# EAGLE design makeblock stepper driver (EAGLE 9.2.2)
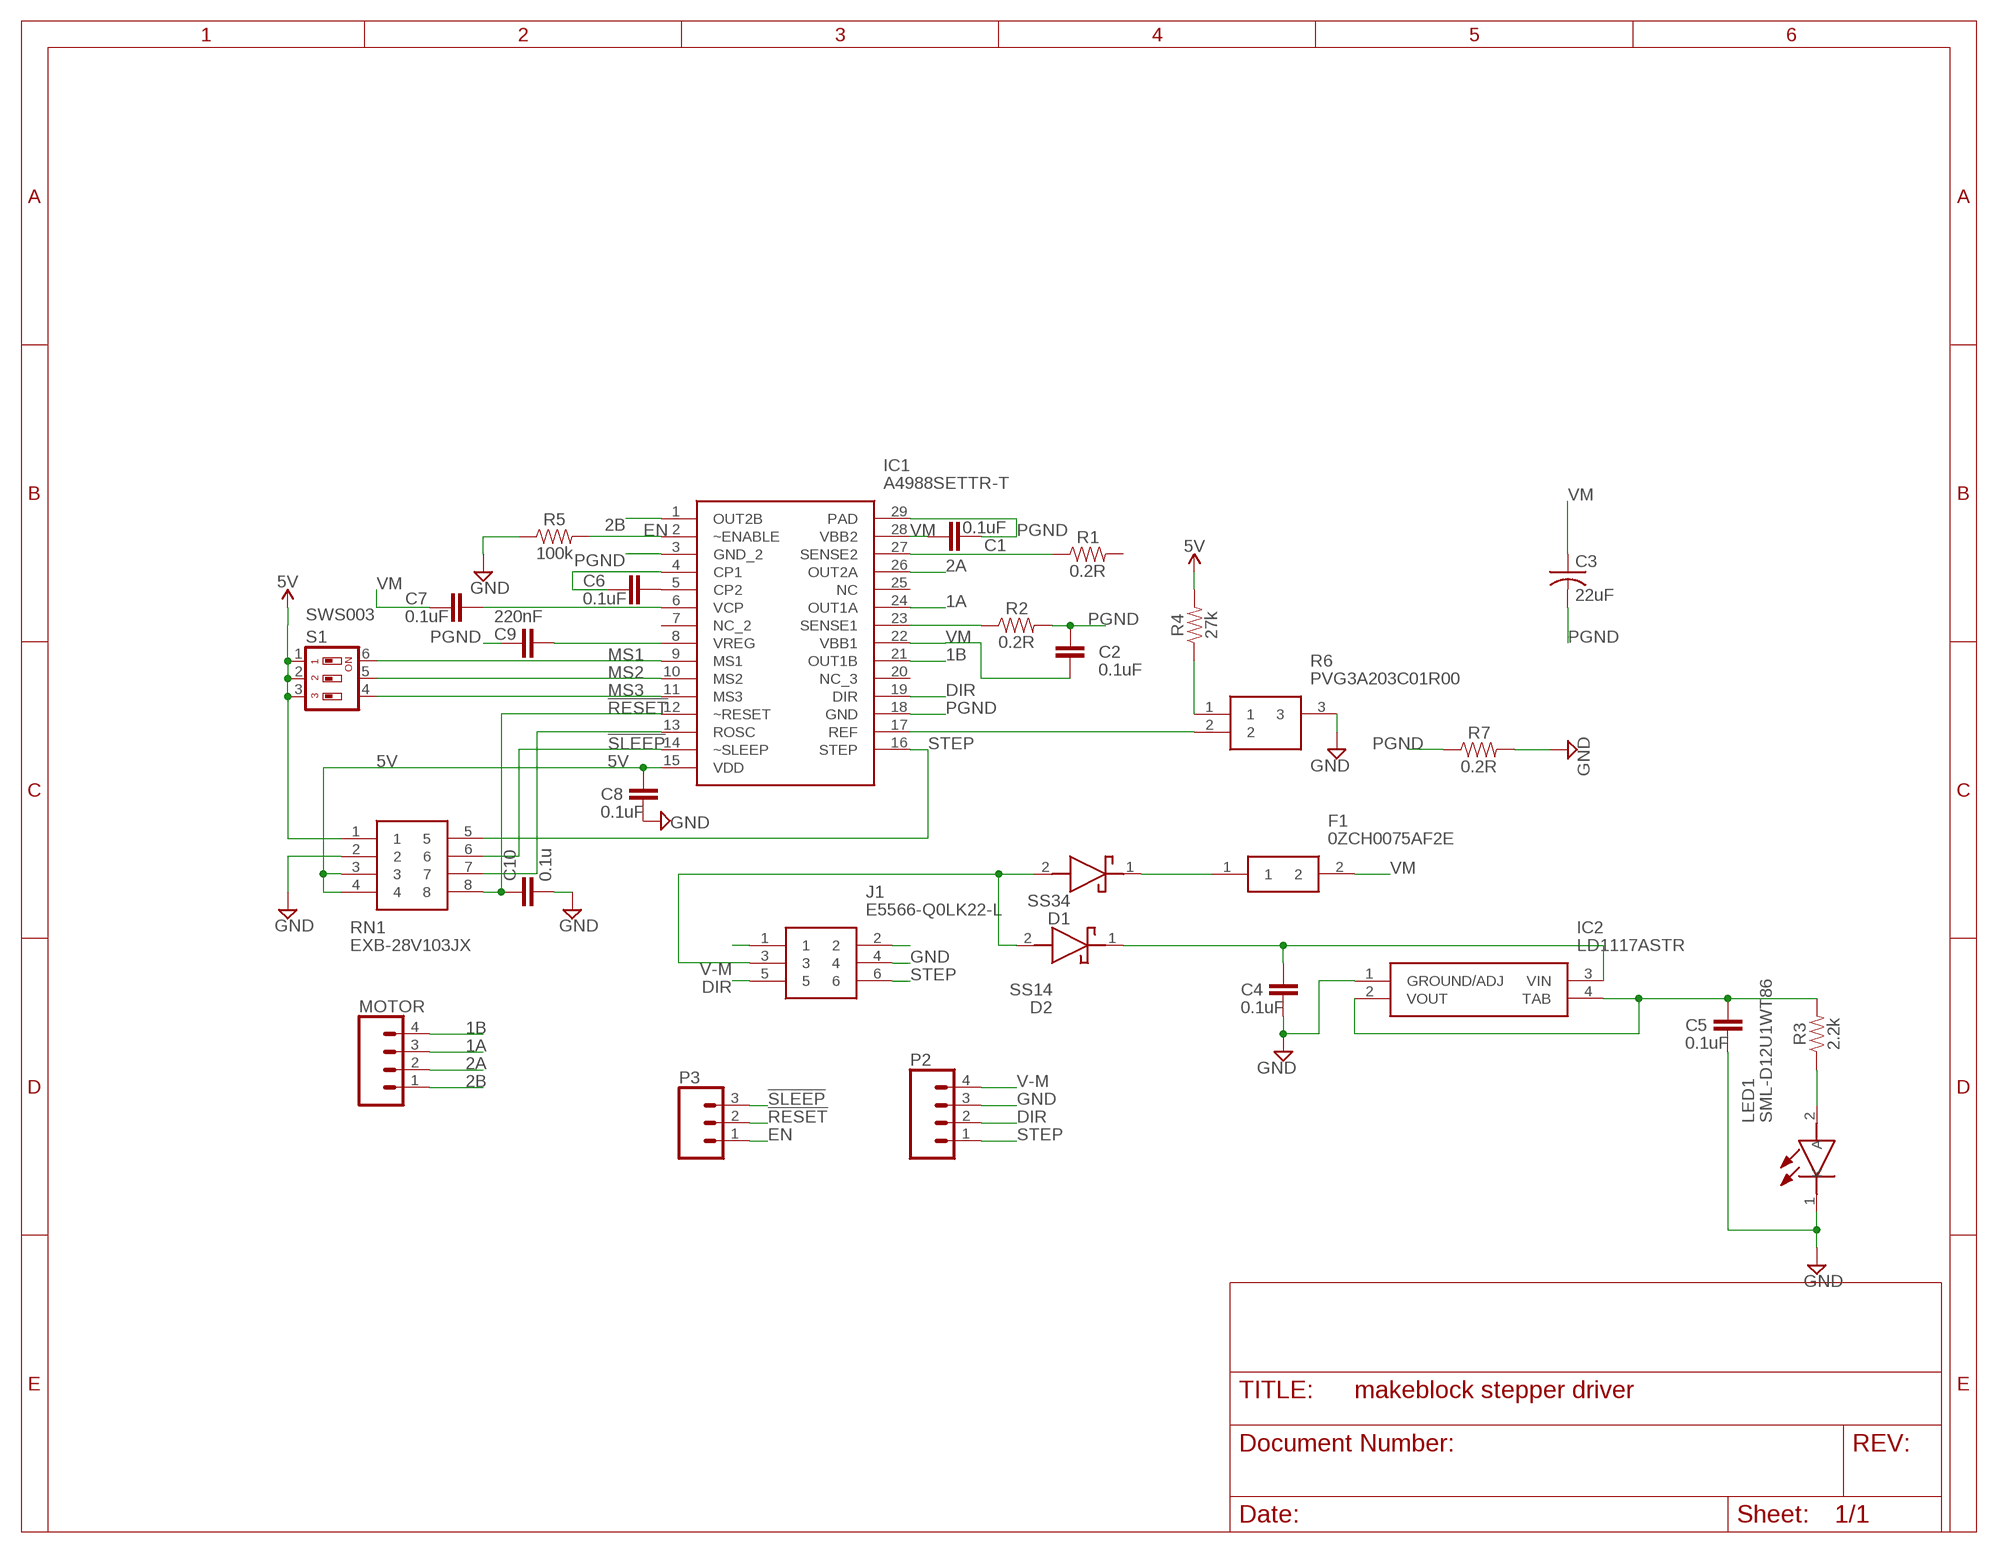
[diagram p0: schematic, sheet 1]

## Parts
C1  0.1uF  C-EUC0402  [C0402]
C2  0.1uF  C-EUC0402  [C0402]
C3  22uF  C-US025-024X044  [C025-024X044]
C4  0.1uF  C-EUC0402  [C0402]
C5  0.1uF  C-EUC0402  [C0402]
C6  0.1uF  C-EUC0402  [C0402]
C7  0.1uF  C-EUC0402  [C0402]
C8  0.1uF  C-EUC0402  [C0402]
C9  220nF  C-EUC0402  [C0402]
C10  0.1u  C-EUC0402  [C0402]
D1  SS34  [DIOM8059X256N]
D2  SS14  [DIOM5227X270N]
F1  0ZCH0075AF2E  [FUSC3226X75N]
IC1  A4988SETTR-T  [QFN50P500X500X100-29N]
IC2  LD1117ASTR  [SOT230P700X180-4N]
J1  E5566-Q0LK22-L  [E5566Q0LK22L]
LED1  SML-D12U1WT86  [LEDC1608X65N]
MOTOR  CONN_04JST-PTH-VERT  [JST-4-PTH-VERT]
P2  CONN_04PTH  [1X04]
P3  CONN_03LOCK  [1X03_LOCK]
R1  0.2R  10MOHM-0603-1/10W-5%  [0603]
R2  0.2R  10MOHM-0603-1/10W-5%  [0603]
R3  2.2k  10MOHM-0603-1/10W-5%  [0603]
R4  27k  10MOHM-0603-1/10W-5%  [0603]
R5  100k  10MOHM-0603-1/10W-5%  [0603]
R6  PVG3A203C01R00  [PVG3A203C01R00]
R7  0.2R  10MOHM-0603-1/10W-5%  [0603]
RN1  EXB-28V103JX  [EXB28V_1]
S1  SWS003  [SMS-003]

## Nets
1A: IC1.24(OUT1A) MOTOR.3
1B: IC1.21(OUT1B) MOTOR.4
2A: IC1.26(OUT2A) MOTOR.2
2B: IC1.1(OUT2B) MOTOR.1
5V: C8.2 IC1.15(VDD) R4.2 RN1.1 RN1.3 RN1.4 S1.1 S1.2 S1.3
!RESET: C10.1 IC1.12(~RESET) P3.2 RN1.8
!SLEEP: IC1.14(~SLEEP) P3.3 RN1.6
DIR: IC1.19(DIR) J1.5 P2.2
EN: IC1.2(~ENABLE) P3.1 R5.2
GND: C4.1 C5.1 C8.1 C10.2 IC2.1(GROUND/ADJ) J1.4 LED1.1(K) P2.3 R5.1 R6.3 R7.2 RN1.2
MS1: IC1.9(MS1) S1.6
MS2: IC1.10(MS2) S1.5
MS3: IC1.11(MS3) S1.4
N$1: C6.2 IC1.5(CP2)
N$2: C6.1 IC1.4(CP1)
N$3: J1.1
N$5: D1.1(K) F1.1
N$6: C4.2 D2.1(K) IC2.3(VIN)
N$7: C9.2 IC1.8(VREG)
N$8: IC1.13(ROSC) RN1.7
N$9: J1.2
N$10: LED1.2(A) R3.1
N$11: C5.2 IC2.2(VOUT) IC2.4(TAB) R3.2
N$13: C7.2 IC1.6(VCP)
N$14: IC1.27(SENSE2) R1.1
N$15: IC1.23(SENSE1) R2.1
N$16: R4.1 R6.1
N$17: IC1.17(REF) R6.2
PGND: C1.1 C2.1 C3.2 C9.1 IC1.3(GND_2) IC1.18(GND) IC1.29(PAD) R2.2 R7.1
STEP: IC1.16(STEP) J1.6 P2.1 RN1.5
V-M: D1.2(A) D2.2(A) J1.3 P2.4
VM: C1.2 C2.2 C3.1 C7.1 F1.2 IC1.22(VBB1) IC1.28(VBB2)
Unconnected: IC1.7(NC_2) IC1.20(NC_3) IC1.25(NC) R1.2

## Library data of the parts
C1 C2 C4-C10 = resistor:C-EU: CAPACITOR, European symbol
C3 = rcl:C-US: CAPACITOR, American symbol; SPICEPREFIX: C
D1 = SamacSys_Parts:SS34: ON Semi SS34 SMT Schottky Diode, 40V 3A, 2-Pin DO-214AB Source: Datasheet <https://componentsearchengine.com/Datasheets/2/SS34.pdf>; DESCRIPTION: ON Semi SS34 SMT Schottky Diode, 40V 3A, 2-Pin DO-214AB; HEIGHT: 2.56mm; MANUFACTURER_NAME: ON Semiconductor; MANUFACTURER_PART_NUMBER: SS34; MOUSER_PART_NUMBER: 512-SS34; RS_PART_NUMBER: 1662321; RS_PRICE-STOCK: http://uk.rs-online.com/web/p/products/1662321
D2 = SamacSys_Parts:SS14: 1.0 A Schottky Barrier Rectifiers Source: Datasheet <http://www.onsemi.com/pub/Collateral/SS19-D.pdf>; DESCRIPTION: 1.0 A Schottky Barrier Rectifiers; HEIGHT: 2.7mm; MANUFACTURER_NAME: ON Semiconductor; MANUFACTURER_PART_NUMBER: SS14; MOUSER_PART_NUMBER: 512-SS14; RS_PART_NUMBER: 1662555; RS_PRICE-STOCK: http://uk.rs-online.com/web/p/products/1662555
F1 = SamacSys_Parts:0ZCH0075AF2E: PTC Resettable Fuse 0.75A(hold) 1.5A(trip) 24VDC 100A 0.6W 0.1s 0.13Ohm SMD Solder Pad 1210 T/R Source: Datasheet <https://www.arrow.com/en/products/0zch0075af2e/bel-group>; DESCRIPTION: PTC Resettable Fuse 0.75A(hold) 1.5A(trip) 24VDC 100A 0.6W 0.1s 0.13Ohm SMD Solder Pad 1210 T/R; HEIGHT: 0.75mm; MANUFACTURER_NAME: Bel-Stewart; MANUFACTURER_PART_NUMBER: 0ZCH0075AF2E; MOUSER_PART_NUMBER: 530-0ZCH0075AF2E; MOUSER_PRICE-STOCK: https://www.mouser.com/Search/Refine.aspx?Keyword=530-0ZCH0075AF2E
IC1 = SamacSys_Parts:A4988SETTR-T: DMOS Microstepping Driver with Translator and Overcurrent Protection Source: Datasheet; DESCRIPTION: DMOS Microstepping Driver with Translator and Overcurrent Protection; HEIGHT: mm; MANUFACTURER_NAME: Allegro Microsystems; MANUFACTURER_PART_NUMBER: A4988SETTR-T
IC2 = SamacSys_Parts:LD1117ASTR: LD1117ASTR, Low Dropout Voltage Regulator, Adjustable 1.2A, 1.25 15 V +/-2%, 4-Pin SOT-223 Source: Datasheet <http://www.st.com/st-web-ui/static/active/en/resource/technical/document/datasheet/CD00002116.pdf>; ALLIED_NUMBER: 70390186; ALLIED_PRICE-STOCK: http://www.alliedelec.com/stmicroelectronics-ld1117astr/70390186/; DESCRIPTION: LD1117ASTR, Low Dropout Voltage Regulator, Adjustable 1.2A, 1.25 15 V +/-2%, 4-Pin SOT-223; HEIGHT: 1.8mm; MANUFACTURER_NAME: STMicroelectronics; MANUFACTURER_PART_NUMBER: LD1117ASTR; MOUSER_PART_NUMBER: 511-LD1117ASTR; MOUSER_PRICE-STOCK: https://www.mouser.com/Search/Refine.aspx?Keyword=511-LD1117ASTR; RS_PART_NUMBER: 7147806; RS_PRICE-STOCK: http://uk.rs-online.com/web/p/products/7147806
J1 = SamacSys_Parts:E5566-Q0LK22-L: Modular Connectors / Ethernet Connectors RJ25 6P6C SIDE ENTRY Source: Datasheet <http://productfinder.pulseeng.com/products/datasheets/CE553027-LC.pdf>; DESCRIPTION: Modular Connectors / Ethernet Connectors RJ25 6P6C SIDE ENTRY; HEIGHT: 14mm; MANUFACTURER_NAME: Pulse; MANUFACTURER_PART_NUMBER: E5566-Q0LK22-L; MOUSER_PART_NUMBER: 673-E5566-Q0LK22-L; MOUSER_PRICE-STOCK: https://www.mouser.com/Search/Refine.aspx?Keyword=673-E5566-Q0LK22-L
LED1 = SamacSys_Parts:SML-D12U1WT86: Standard LEDs - SMD Red 620nm 63mcd Vf 2.2V Pd 54mW Source: Datasheet <https://componentsearchengine.com/Datasheets/1/SML-D12U1WT86.pdf>; DESCRIPTION: Standard LEDs - SMD Red 620nm 63mcd Vf 2.2V Pd 54mW; HEIGHT: 0.65mm; MANUFACTURER_NAME: ROHM Semiconductor; MANUFACTURER_PART_NUMBER: SML-D12U1WT86; MOUSER_PART_NUMBER: 755-SML-D12U1WT86; MOUSER_PRICE-STOCK: https://www.mouser.com/Search/Refine.aspx?Keyword=755-SML-D12U1WT86; RS_PART_NUMBER: 1332870; RS_PRICE-STOCK: http://uk.rs-online.com/web/p/products/1332870
MOTOR = SparkFun-Connectors:CONN_04: Multi connection point. Often used as Generic Header-pin footprint for 0.1 inch spaced/style header connections On any of the 0.1 inch spaced packages, you can populate with these: Break Away Headers - Straight <https://www.sparkfun.com/products/116> (PRT-00116) Break Away Male Headers - Right Angle <https://www.sparkfun.com/products/553> (PRT-00553) Female Headers <https://www.sparkfun.com/products/115> (PRT-00115) Break Away Headers - Machine Pin <https://www.sparkfun.com/products/117> (PRT-00117) Break Away Female Headers - Swiss Machine Pin <https://www.sparkfun.com/products/743> (PRT-00743) For SCREWTERMINALS and SPRING TERMINALS visit here: Screw Terimnals on SparkFun.com <https://www.sparkfun.com/search/results?term=Screw+Terminals> (5mm/3.5mm/2.54mm spacing) This device is also useful as a general connection point to wire up your design to another part of your project. Our various solder wires solder well into these plated through hole pads. Hook-Up Wire - Assortment (Stranded, 22 AWG) <https://www.sparkfun.com/products/11375> (PRT-11375) Hook-Up Wire - Assortment (Solid Core, 22 AWG) <https://www.sparkfun.com/products/11367> (PRT-11367) View the entire wire category on our website here <https://www.sparkfun.com/categories/141> Special notes: Molex polarized connector foot print use with SKU : PRT-08231 with associated crimp pins and housings. 1MM SMD Version SKU: PRT-10208; PROD_ID: CONN-13251
P2 = SparkFun-Connectors:CONN_04: Multi connection point. Often used as Generic Header-pin footprint for 0.1 inch spaced/style header connections On any of the 0.1 inch spaced packages, you can populate with these: Break Away Headers - Straight <https://www.sparkfun.com/products/116> (PRT-00116) Break Away Male Headers - Right Angle <https://www.sparkfun.com/products/553> (PRT-00553) Female Headers <https://www.sparkfun.com/products/115> (PRT-00115) Break Away Headers - Machine Pin <https://www.sparkfun.com/products/117> (PRT-00117) Break Away Female Headers - Swiss Machine Pin <https://www.sparkfun.com/products/743> (PRT-00743) For SCREWTERMINALS and SPRING TERMINALS visit here: Screw Terimnals on SparkFun.com <https://www.sparkfun.com/search/results?term=Screw+Terminals> (5mm/3.5mm/2.54mm spacing) This device is also useful as a general connection point to wire up your design to another part of your project. Our various solder wires solder well into these plated through hole pads. Hook-Up Wire - Assortment (Stranded, 22 AWG) <https://www.sparkfun.com/products/11375> (PRT-11375) Hook-Up Wire - Assortment (Solid Core, 22 AWG) <https://www.sparkfun.com/products/11367> (PRT-11367) View the entire wire category on our website here <https://www.sparkfun.com/categories/141> Special notes: Molex polarized connector foot print use with SKU : PRT-08231 with associated crimp pins and housings. 1MM SMD Version SKU: PRT-10208; PROD_ID: CONN-09696
P3 = SparkFun-Connectors:CONN_03: Multi connection point. Often used as Generic Header-pin footprint for 0.1 inch spaced/style header connections On any of the 0.1 inch spaced packages, you can populate with these: Break Away Headers - Straight <https://www.sparkfun.com/products/116> (PRT-00116) Break Away Male Headers - Right Angle <https://www.sparkfun.com/products/553> (PRT-00553) Female Headers <https://www.sparkfun.com/products/115> (PRT-00115) Break Away Headers - Machine Pin <https://www.sparkfun.com/products/117> (PRT-00117) Break Away Female Headers - Swiss Machine Pin <https://www.sparkfun.com/products/743> (PRT-00743) Stackable Header - 3 Pin (Female, 0.1") <https://www.sparkfun.com/products/13875> (PRT-13875) For SCREWTERMINALS and SPRING TERMINALS visit here: Screw Terimnals on SparkFun.com <https://www.sparkfun.com/search/results?term=Screw+Terminals> (5mm/3.5mm/2.54mm spacing) This device is also useful as a general connection point to wire up your design to another part of your project. Our various solder wires solder well into these plated through hole pads. Hook-Up Wire - Assortment (Stranded, 22 AWG) <https://www.sparkfun.com/products/11375> (PRT-11375) Hook-Up Wire - Assortment (Solid Core, 22 AWG) <https://www.sparkfun.com/products/11367> (PRT-11367) View the entire wire category on our website here <https://www.sparkfun.com/categories/141> Special notes: Molex polarized connector foot print use with SKU : PRT-08232 with associated crimp pins and housings.
R1-R5 R7 = SparkFun-Resistors:10MOHM: RES-09327; PROD_ID: RES-08283; VALUE: 10M
R6 = SamacSys_Parts:PVG3A203C01R00: Murata PVG3 Series SMD Trimmer Resistor with J-Hook Terminations, 20k +/-20% 1/4W +/-150ppm/C Top Adjust Source: Datasheet <https://www.murata.com/en-eu/api/pdfdownloadapi?cate=cgsubTrimmPoten&partno=PVG3A203C01R00>; DESCRIPTION: Murata PVG3 Series SMD Trimmer Resistor with J-Hook Terminations, 20k +/-20% 1/4W +/-150ppm/C Top Adjust; HEIGHT: 2mm; MANUFACTURER_NAME: Murata Electronics; MANUFACTURER_PART_NUMBER: PVG3A203C01R00; RS_PART_NUMBER: 7250053P; RS_PRICE-STOCK: http://uk.rs-online.com/web/p/products/7250053P
RN1 = SamacSys_Parts:EXB-28V103JX: Resistor Networks & Arrays 10K OHM 5% Source: Datasheet <https://industrial.panasonic.com/cdbs/www-data/pdf/AOC0000/AOC0000C14.pdf>; ALLIED_NUMBER: 70552627; ALLIED_PRICE-STOCK: https://www.alliedelec.com/panasonic-exb28v103jx/70552627/; DESCRIPTION: Resistor Networks & Arrays 10K OHM 5%; HEIGHT: mm; MANUFACTURER_NAME: Panasonic; MANUFACTURER_PART_NUMBER: EXB-28V103JX; MOUSER_PART_NUMBER: 667-EXB-28V103JX; MOUSER_PRICE-STOCK: https://www.mouser.com/Search/Refine.aspx?Keyword=667-EXB-28V103JX
S1 = smd-special:SWS003: SMD Dip Switch 3 pol.

## Board
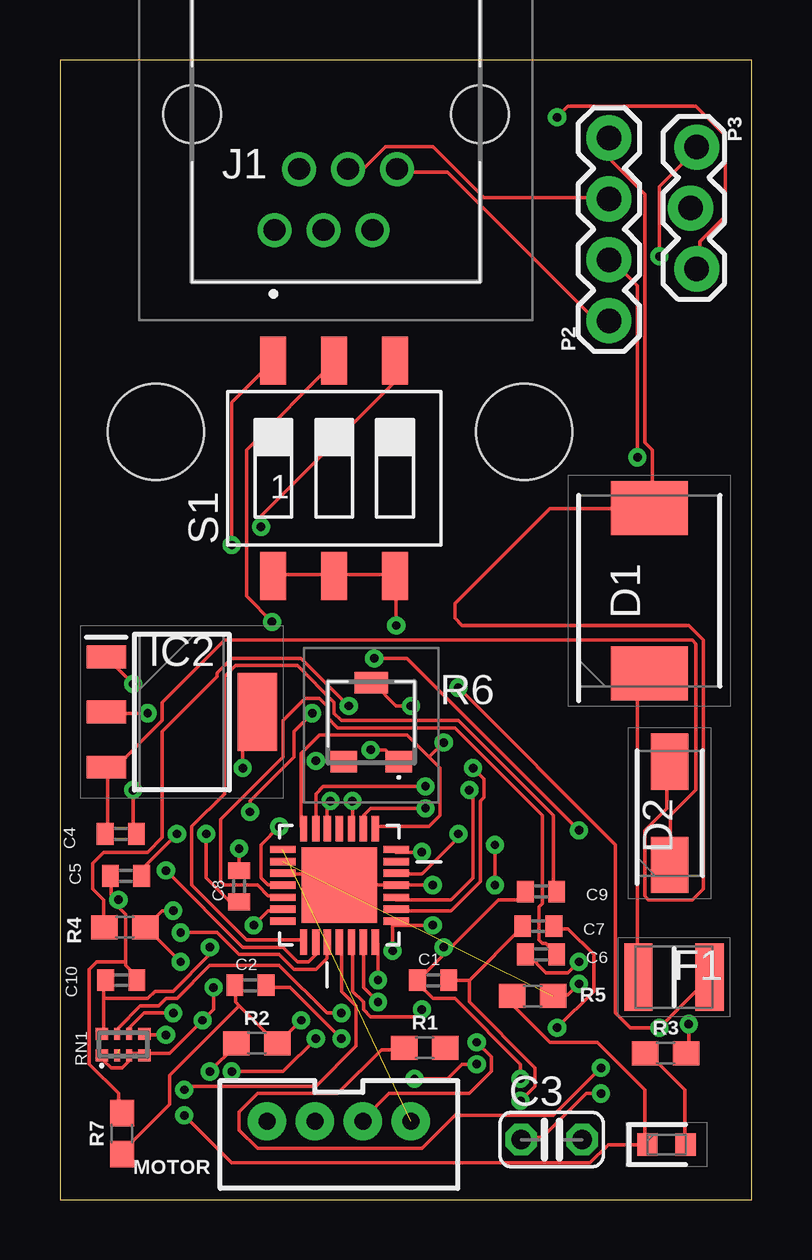
[diagram p1: board, top side]
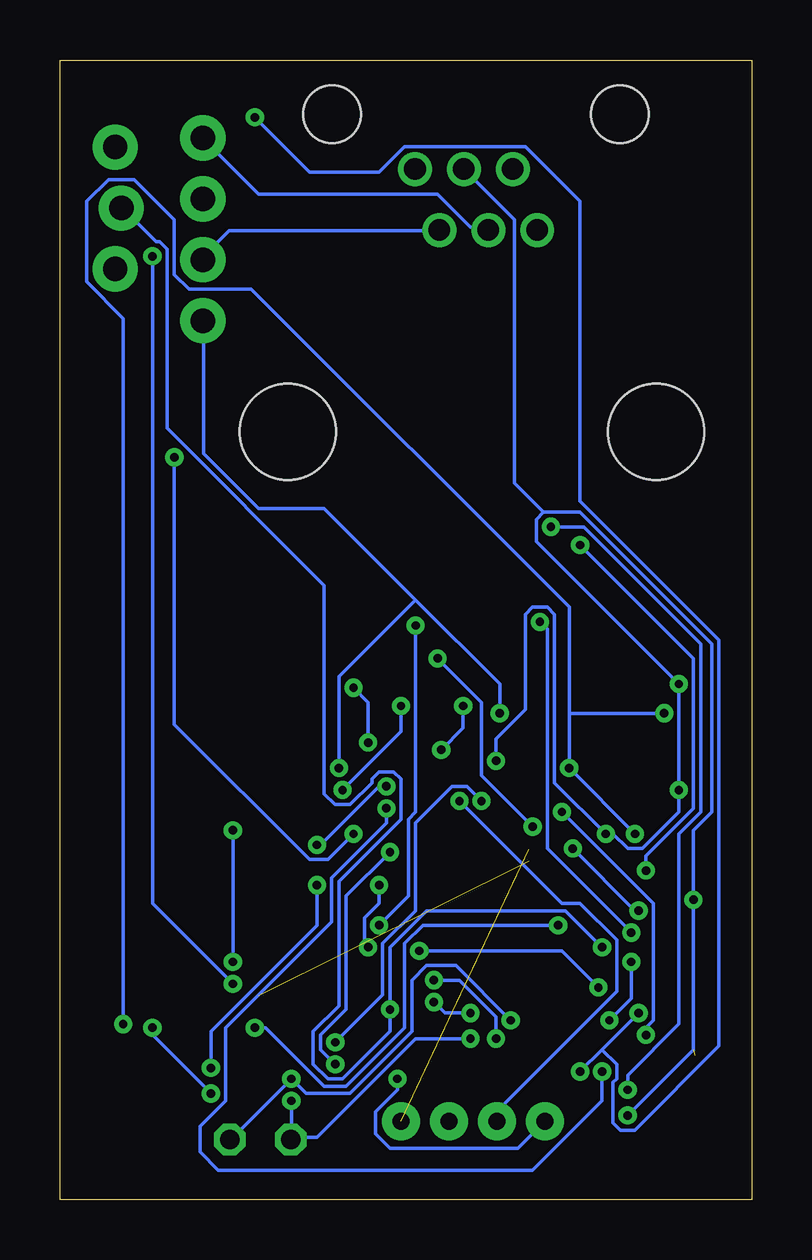
[diagram p2: board, bottom side, seen from below]

Size 28.85 x 47.5 mm. Coordinates in mm from the lower left corner, seen from the top.
Outline: 0,0 28.85,0 28.85,47.5 0,47.5 0,0
Copper layers (1*16): Top 0.035mm / dielectric 1.5mm / Bottom 0.035mm
Design rules "default": minimum track width 6mil, minimum drill 0.35mm, track to track 6mil, track to pad 6mil, pad to pad 6mil, via to via 6mil, smd to smd 6mil, copper to edge 40mil, drill to drill 6mil, minimum pad ring 10mil, minimum via ring 8mil, stop-mask expansion 4mil, vias tented up to drill 0mil, thermal gap 10mil
Holes 4 mm at 19.35,32 4,32

### Footprints (pad centres in the part's own frame; a part is rotated, then mirrored left to right if it is on the bottom)
C0402 = smd 0.7 x 0.9: 1 -0.65,0; 2 0.65,0
C025-024X044 = drill 0.813 octagon: 1 -1.27,0; 2 1.27,0
DIOM8059X256N = smd 2.25 x 3.2: 1 -3.45,0; 2 3.45,0
DIOM5227X270N = smd 2.35 x 1.55: 1 -2.15,0; 2 2.15,0
FUSC3226X75N = smd 1.18 x 2.81: 1 -1.485,0; 2 1.485,0
QFN50P500X500X100-29N = smd 1.067 x 0.305: 1 -2.362,1.499; 2 -2.362,0.991; 3 -2.362,0.508; 4 -2.362,0; 5 -2.362,-0.508; 6 -2.362,-0.991; 7 -2.362,-1.499; 15 2.362,-1.499; 16 2.362,-0.991; 17 2.362,-0.508; 18 2.362,0; 19 2.362,0.508; 20 2.362,0.991; 21 2.362,1.499 | smd 0.305 x 1.067: 8 -1.499,-2.362; 9 -0.991,-2.362; 10 -0.508,-2.362; 11 0,-2.362; 12 0.508,-2.362; 13 0.991,-2.362; 14 1.499,-2.362; 22 1.499,2.362; 23 0.991,2.362; 24 0.508,2.362; 25 0,2.362; 26 -0.508,2.362; 27 -0.991,2.362; 28 -1.499,2.362 | smd 3.15 x 3.15: 29 0,0
SOT230P700X180-4N = smd 1.65 x 0.95: 1 -3.15,2.3; 2 -3.15,0; 3 -3.15,-2.3 | smd 1.65 x 3.25: 4 3.15,0
E5566Q0LK22L = drill 0.9 pad 1.4: 1 2.55,4.04; 2 1.53,1.5; 3 0.51,4.04; 4 -0.51,1.5; 5 -1.53,4.04; 6 -2.55,1.5 | hole 2.4: -6,-0.8; 6,-0.8
LEDC1608X65N = smd 0.85 x 0.95: 1 -0.8,0; 2 0.8,0
JST-4-PTH-VERT = drill 0.7 pad 1.6: 1 -3,-0.55; 2 -1,-0.55; 3 1,-0.55; 4 3,-0.55
1X04 = drill 1.016 pad 1.88: 1 0,0; 2 2.54,0; 3 5.08,0; 4 7.62,0
1X03_LOCK = drill 1.016 pad 1.88: 1 0,0.127; 2 2.54,-0.127; 3 5.08,0.127
0603 = smd 1.1 x 1: 1 -0.85,0; 2 0.85,0
PVG3A203C01R00 = smd 1.1 x 0.9: 1 1.15,-1.525; 3 -1.15,-1.525 | smd 1.4 x 0.9: 2 0,1.775
EXB28V_1 = smd 0.525 x 0.5: 1 -0.887,-0.45; 4 0.887,-0.45; 5 0.887,0.45; 8 -0.887,0.45 | smd 0.25 x 0.5: 2 -0.25,-0.45; 3 0.25,-0.45; 6 0.25,0.45; 7 -0.25,0.45
SMS-003 = smd 1.092 x 2.007: 1 -2.54,-4.496; 2 0,-4.496; 3 2.54,-4.496; 4 2.54,4.496; 5 0,4.496; 6 -2.54,4.496

### Placement (x,y rotation side)
C1  15.56,9.14 0 top
C2  7.94,8.93 0 top
C3  20.5,2.5 0 top
C4  2.54,15.24 180 top
C5  2.75,13.49 0 top
C6  20.06,10.22 0 top
C7  19.94,11.4 0 top
C8  7.47,13.06 90 top
C9  20.06,12.84 0 top
C10  2.56,9.15 0 top
D1  24.57,25.37 90 top
D2  25.42,16.1 90 top
F1  25.6,9.27 0 top
IC1  11.65,13.1 0 top
IC2  5.08,20.32 0 top
J1  11.5,44.45 180 top
LED1  25.29,2.29 0 top
MOTOR  11.63,2.71 180 top
P2  22.89,36.63 90 top
P3  26.42,43.87 270 top
R1  15.21,6.32 0 top
R2  8.21,6.51 0 top
R3  25.25,6.1 0 top
R4  2.71,11.35 0 top
R5  19.71,8.48 0 top
R6  12.98,19.77 0 top
R7  2.59,2.75 90 top
RN1  2.64,6.46 0 top
S1  11.43,30.48 0 top

### Tracks (layer width: path | path; a pad name or v marks a point on that pad's centre or on a via)
1A  (via drill 0.35)
  Top 0.152: v12.19,16.61 12.19,15.54 IC1.24
  Bottom 0.152: v12.19,16.61 7.92,12.34 7.16,12.34 5.64,10.82 5.64,8.69 10.52,3.81 10.52,3.35 MOTOR.3
1B  (via drill 0.35)
  Top 0.152: v15.09,14.48 14.02,14.48 IC1.21 | v17.37,5.64 16.76,5.64 16.15,5.03 v14.78,5.03
  Bottom 0.152: v15.09,14.48 16.92,12.65 16.92,7.92 17.98,6.86 17.98,6.25 v17.37,5.64 | v14.78,5.03 14.78,4.57 15.7,3.66 15.7,2.74 15.09,2.13 9.75,2.13 8.69,3.2 MOTOR.4
2A  (via drill 0.35)
  Top 0.152: v11.28,16.61 11.12,16.46 11.12,15.54 IC1.26 | v17.37,6.55 17.98,5.94 17.98,5.33 17.07,4.42 13.72,4.42 12.65,3.35 MOTOR.2
  Bottom 0.152: v11.28,16.61 11.89,17.22 12.5,17.22 14.02,15.7 14.02,12.04 15.39,10.67 15.39,8.53 v17.37,6.55
2B  (1 unrouted)
5V  (via drill 0.35)
  Top 0.152: 11.43,26.06 8.99,26.06 S1.1 | 11.43,26.06 S1.2 11.43,26.06 | 11.43,26.06 13.87,26.06 S1.3 14.02,25.91 v14.02,23.93 | v7.47,14.63 C8.2 | v4.72,12.04 4.27,12.04 3.66,11.43 R4.2 3.66,11.28 v5.03,9.91 | RN1.1 1.83,5.94 1.83,5.79 2.13,5.49 2.59,5.49 2.9,5.79 2.9,5.94 RN1.3 2.9,6.1 3.5,6.1 RN1.4 3.66,6.1 4.57,6.1 v5.94,7.47 6.4,7.92 v6.4,8.84 | v13.87,10.36 13.87,11.43 | 13.87,11.43 13.87,11.58 IC1.15 | 13.87,11.43 v15.54,11.43
  Bottom 0.152: v7.47,14.63 4.88,12.04 v4.72,12.04 | v13.87,10.36 7.92,10.36 v6.4,8.84 | v5.03,9.91 5.03,8.38 v5.94,7.47 | v14.02,23.93 14.02,16.15 14.33,15.85 14.33,12.65 v15.54,11.43
!RESET  (via drill 0.35)
  Top 0.152: 1.83,8.38 1.83,9.14 C10.1 | 1.83,8.38 1.83,7.01 RN1.8 | v15.09,7.92 14.78,7.62 12.95,7.62 12.65,7.92 12.65,8.23 12.19,8.69 12.19,10.67 IC1.12 | v6.25,10.52 6.25,10.21 4.72,8.69 3.96,8.69 3.66,8.38 1.83,8.38
  Bottom 0.152: v6.25,10.52 7.77,12.04 13.56,12.04 15.09,10.52 v15.09,7.92 15.09,7.01 17.07,5.03 17.68,5.03 18.29,5.64 18.29,7.01 17.22,8.08 17.22,13.26 14.63,15.85 14.63,17.53 14.94,17.83 15.54,17.83 15.85,17.53 15.85,17.37 16.76,16.46 17.37,16.46 17.83,16.92 17.83,25.6 24.38,32.16 24.38,39.62 24.69,39.93 24.84,39.93 26.21,41.3 P3.2
!SLEEP  (via drill 0.35)
  Top 0.152: v4.72,7.77 3.5,7.77 2.9,7.16 2.9,7.01 RN1.6 | v7.16,5.33 9.3,5.33 v10.67,6.71 | v13.26,9.14 13.26,10.67 IC1.14 | v20.73,45.11 21.18,45.57 26.52,45.57 27.74,44.35 27.74,41 26.67,39.93 26.67,38.86 P3.3
  Bottom 0.152: v7.16,5.33 6.25,6.25 | 6.25,6.25 v4.72,7.77 | v10.67,6.71 10.67,7.62 12.19,9.14 v13.26,9.14 | v20.73,45.11 18.44,42.82 15.54,42.82 14.48,43.89 9.45,43.89 7.16,41.6 7.16,29.11 1.37,23.32 1.37,6.4 4.88,2.9 5.49,2.9 5.79,3.2 5.79,4.88 5.64,5.03 5.64,5.64 6.25,6.25
DIR  (via drill 0.35)
  Top 0.152: v16.61,15.24 16.61,15.09 15.09,13.56 14.02,13.56 IC1.19 | v24.08,30.94 24.08,38.1 23.01,39.17 P2.2
  Bottom 0.152: v16.61,15.24 17.68,14.17 18.44,14.17 24.08,19.81 v24.08,30.94 | J1.5 13.11,40.39 21.79,40.39 22.86,39.32 P2.2
EN  (via drill 0.35)  (1 unrouted)
  Top 0.152: v21.64,8.99 21.18,8.53 20.57,8.53 R5.2 | v24.99,39.32 24.99,42.22 26.52,43.74 P3.1
  Bottom 0.152: v21.64,8.99 24.99,12.34 v24.99,39.32
GND  (via drill 0.35)  (1 unrouted)
  Top 0.152: J1.4 12.04,42.98 12.65,42.98 13.56,43.89 15.54,43.89 17.68,41.76 22.86,41.76 P2.3 | R5.1 18.9,8.38 18.9,8.08 20.42,6.55 22.4,6.55 24.38,4.57 24.38,2.44 LED1.1 24.38,2.29 22.86,2.29 22.1,1.52 7.16,1.52 v5.18,3.5 | 2.29,12.34 2.74,11.89 2.74,9.91 | 2.29,12.34 2.13,12.5 2.13,13.41 C5.1 | 2.74,9.91 2.74,9.75 3.2,9.3 C10.2 | 2.74,9.91 1.52,9.91 1.22,9.6 1.22,5.64 2.44,4.42 2.44,3.66 R7.2 | v3.05,17.07 3.05,15.24 C4.1 | v3.05,21.49 1.98,22.55 IC2.1 | v6.1,15.24 6.1,13.41 7.01,12.5 7.47,12.5 C8.1 | v10.67,18.29 11.73,18.29 R6.3 | v2.44,12.5 2.29,12.34
  Bottom 0.152: v10.67,18.29 10.67,19.2 9.45,20.42 9.45,24.38 9.14,24.69 8.53,24.69 8.23,24.38 8.23,17.37 v6.1,15.24 5.79,15.24 5.18,14.63 4.57,14.63 3.05,16.15 v3.05,17.07 v3.05,21.49 8.99,27.43 8.99,28.35 8.69,28.65 | 8.69,28.65 7.16,28.65 1.68,23.16 1.68,16.15 2.44,15.39 v2.44,12.5 2.44,6.25 v5.18,3.5 | 8.69,28.65 9.91,29.87 9.91,40.84 11.89,42.82 J1.4
MS1  (via drill 0.35)
  Top 0.152: v4.42,13.72 7.62,10.52 9.3,10.52 9.91,9.91 10.36,9.91 10.67,10.21 10.67,10.67 IC1.9 | v7.16,27.28 7.16,33.22 8.84,34.9 S1.6
  Bottom 0.152: v4.42,13.72 4.42,14.33 2.44,16.31 2.44,22.55 v7.16,27.28
MS2  (via drill 0.35)
  Top 0.152: v5.03,11.12 6.55,11.12 7.47,10.21 9.14,10.21 9.75,9.6 10.67,9.6 11.12,10.06 11.12,10.67 IC1.10 | v8.84,24.08 7.77,25.15 7.77,31.24 11.43,34.9 S1.5
  Bottom 0.152: v5.03,11.12 8.53,14.63 8.53,23.77 v8.84,24.08
MS3  (via drill 0.35)
  Top 0.152: v5.18,4.57 5.33,4.72 10.67,4.72 12.34,6.4 12.34,8.08 11.73,8.69 11.73,10.67 IC1.11 | v8.38,28.04 8.38,28.5 13.87,33.98 13.87,34.9 S1.4
  Bottom 0.152: v5.18,4.57 5.18,5.18 3.05,7.32 3.05,15.24 2.13,16.15 2.13,23.16 7.01,28.04 v8.38,28.04
N$1
  Top 0.152: C6.2 20.57,10.36 20.27,10.67 20.12,10.67 19.96,10.82 19.96,12.19 20.12,12.34 20.12,16 16.46,19.66 11.58,19.66 11.12,20.12 11.12,20.57 10.82,20.88 10.21,20.88 9.3,19.96 9.3,18.44 6.71,15.85 6.71,13.26 6.86,13.11 8.23,13.11 8.69,12.65 9.14,12.65 IC1.5
N$2  (via drill 0.35)
  Top 0.152: v21.64,9.91 21.18,9.45 20.27,9.45 19.51,10.21 C6.1 | v21.64,15.39 14.48,22.55 v13.11,22.55 | v9.14,15.54 8.38,14.78 8.38,13.41 8.69,13.11 9.14,13.11 IC1.4
  Bottom 0.152: v21.64,15.39 v21.64,9.91 | v13.11,22.55 11.28,20.73 11.28,17.68 v9.14,15.54
N$5
  Top 0.152: F1.1 24.08,9.3 24.08,21.34 24.54,21.79 D1.1
N$6
  Top 0.152: C4.2 1.98,15.24 1.98,17.98 IC2.3 1.98,18.14 2.44,18.14 4.27,19.96 4.27,20.73 6.86,23.32 26.36,23.32 26.52,23.16 26.52,17.07 25.45,16 25.45,14.02 D2.1
N$7
  Top 0.152: C9.2 20.57,12.95 20.57,16 16.61,19.96 11.73,19.96 11.43,20.27 11.43,20.73 9.91,22.25 7.32,22.25 6.86,21.79 6.86,16.92 5.49,15.54 5.49,13.11 7.77,10.82 10.06,10.82 IC1.8
N$8  (via drill 0.35)
  Top 0.152: v11.73,7.77 11.12,7.77 9.14,9.75 6.25,9.75 4.88,8.38 4.42,8.38 4.12,8.08 3.35,8.08 2.44,7.16 2.44,7.01 RN1.7 | v13.26,8.23 12.65,8.84 12.65,10.67 IC1.13
  Bottom 0.152: v11.73,7.77 12.8,7.77 v13.26,8.23
N$10
  Top 0.152: LED1.2 26.06,2.44 26.06,4.57 24.54,6.1 R3.1
N$11  (via drill 0.35)
  Top 0.152: v4.88,15.24 3.5,13.87 3.5,13.56 C5.2 | v7.62,17.98 7.62,19.66 8.23,20.27 IC2.4 | v26.21,7.32 26.21,6.25 R3.2 | v3.66,20.27 1.98,20.27 IC2.2
  Bottom 0.152: v4.88,15.24 v7.62,17.98 7.62,20.27 | v26.21,7.32 26.21,36.73 27.74,38.25 27.74,41.6 26.82,42.52 25.76,42.52 24.08,40.84 24.08,38.56 23.47,37.95 20.88,37.95 7.62,24.69 7.62,20.27 | 7.62,20.27 v3.66,20.27
N$13  (via drill 0.35)
  Top 0.152: v20.73,7.16 22.25,8.69 22.25,10.21 21.18,11.28 20.73,11.28 C7.2 | v8.08,11.43 8.69,12.04 9.14,12.04 IC1.6
  Bottom 0.152: v20.73,7.16 20.27,7.16 17.83,4.72 16.92,4.72 14.48,7.16 14.48,10.67 13.72,11.43 v8.08,11.43
N$14  (via drill 0.35)
  Top 0.152: v15.24,17.22 10.97,17.22 10.67,16.92 10.67,15.54 IC1.27 | v18.14,13.11 v18.14,14.78 | v22.55,5.49 20.57,3.5 16.46,3.5 15.09,2.13 8.23,2.13 7.47,2.9 7.47,3.66 8.23,4.42 11.58,4.42 13.41,6.25 14.33,6.25 R1.1
  Bottom 0.152: v15.24,17.22 15.54,17.22 17.98,14.78 v18.14,14.78 | v18.14,13.11 18.14,11.43 22.55,7.01 v22.55,5.49
N$15  (via drill 0.35)
  Top 0.152: v15.24,16.31 12.95,16.31 12.65,16 12.65,15.54 IC1.23 | v6.25,5.33 7.32,6.4 R2.1
  Bottom 0.152: v15.24,16.31 15.24,15.7 17.53,13.41 17.53,11.58 21.95,7.16 21.95,4.12 23.01,3.05 23.01,1.98 22.25,1.22 9.14,1.22 6.25,4.12 v6.25,5.33
N$16  (via drill 0.35)
  Top 0.152: v12.04,20.57 10.06,22.55 7.16,22.55 6.55,21.95 6.55,21.79 4.27,19.51 4.27,15.09 3.66,14.48 1.83,14.48 1.37,14.02 1.37,12.95 1.83,12.5 1.83,11.43 R4.1 | v12.95,18.75 13.56,18.75 14.02,18.29 R6.1
  Bottom 0.152: v12.04,20.57 12.04,19.66 v12.95,18.75
N$17  (via drill 0.35)
  Top 0.152: v17.07,17.07 17.22,16.92 17.22,13.41 16.31,12.5 14.02,12.5 IC1.17 | v14.63,20.57 14.02,20.57 13.11,21.49 R6.2
  Bottom 0.152: v17.07,17.07 14.63,19.51 v14.63,20.57
PGND  (via drill 0.35)
  Top 0.152: 7.47,8.08 8.99,6.55 R2.2 9.14,6.55 v10.06,7.47 | 7.47,8.08 7.32,8.23 7.32,8.84 C2.1 | 7.47,8.08 4.57,5.18 4.57,3.96 2.59,1.98 R7.1 | IC1.3 9.3,13.56 11.12,13.56 11.58,13.11 IC1.29 11.73,13.11 13.87,13.11 IC1.18 14.02,13.11 v15.54,13.11 | 16.15,10.36 18.29,12.5 19.05,12.5 19.36,12.8 C9.1 | 16.15,10.36 14.94,9.14 C1.1 14.94,8.99 15.54,8.38 16.46,8.38 19.2,5.64 v19.2,5.03 | 16.15,10.36 v16,10.52
  Bottom 0.152: C3.2 21.64,2.59 v19.2,5.03 18.59,4.42 16.76,4.42 14.17,7.01 14.17,9.14 13.56,9.75 12.34,9.75 v10.06,7.47 | v15.54,13.11 15.54,12.34 16.15,11.73 16.15,10.67 v16,10.52
STEP  (via drill 0.35)
  Top 0.152: v4.42,6.86 3.66,6.86 RN1.5 | v7.92,16.15 7.92,16.61 9.75,18.44 9.75,19.51 v10.52,20.27 | v17.22,17.98 17.68,17.53 17.68,16.76 17.53,16.61 17.53,13.26 16.31,12.04 14.02,12.04 IC1.16 | J1.6 14.17,42.82 16.15,42.82 22.25,36.73 22.86,36.73 P2.1
  Bottom 0.152: v4.42,6.86 4.42,7.16 4.12,7.47 4.12,12.34 v7.92,16.15 | v10.52,20.27 10.52,21.49 14.02,24.99 | 14.02,24.99 17.83,28.8 20.57,28.8 22.86,31.09 22.86,36.58 P2.1 | v17.22,17.98 17.22,21.79 14.02,24.99
V-M
  Top 0.152: D2.2 25.3,18.14 25.3,16.31 24.38,15.39 24.38,12.65 24.54,12.5 26.36,12.5 26.82,12.95 26.82,23.32 26.21,23.93 16.76,23.93 16.46,24.23 16.46,24.84 20.42,28.8 24.54,28.8 D1.2 24.69,28.96 24.69,31.24 24.38,31.55 24.38,41.91 23.01,43.28 23.01,44.2 P2.4
  Bottom 0.152: J1.3 11.12,40.54 11.73,40.54 13.11,41.91 20.57,41.91 22.86,44.2 P2.4
VM  (via drill 0.35)
  Top 0.152: 15.39,18.44 15.85,17.98 15.85,16 15.39,15.54 13.26,15.54 IC1.22 | 15.39,18.44 14.48,19.36 10.82,19.36 10.06,18.59 10.06,15.54 IC1.28 | 17.07,9.14 16.31,9.14 C1.2 | 17.07,9.14 19.2,11.28 C7.1 | v11.73,6.71 9.6,8.84 8.69,8.84 C2.2 | 17.07,9.14 17.07,8.23 19.81,5.49 19.81,4.72 v19.2,4.12 | v22.55,4.42 21.95,4.42 20.12,2.59 19.36,2.59 C3.1 | F1.2 26.98,9.14 v24.99,7.16 23.77,7.16 23.16,7.77 23.16,14.78 v16.61,21.34 | v16,19.05 15.39,18.44
  Bottom 0.152: v11.73,6.71 14.02,6.71 18.14,2.59 19.2,2.59 | 19.2,2.59 C3.1 19.2,2.59 | 19.2,2.59 v19.2,4.12 | v24.99,7.16 24.99,6.86 v22.55,4.42 | v16,19.05 16,20.73 v16.61,21.34